# Altium schematic sheet bootloader.SchDoc
size A4
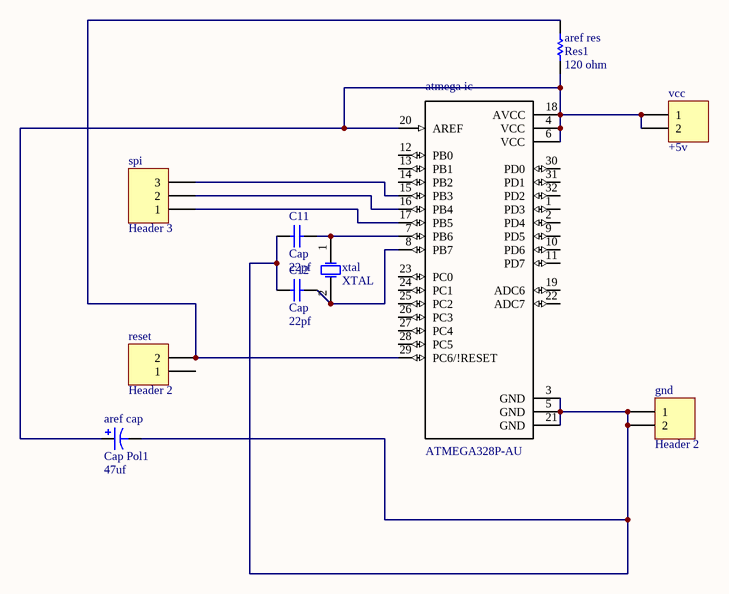
[diagram p0: bootloader.SchDoc]

## Parts
aref_cap  Cap Pol1  value 47uf  [RB7.6-15]
aref_res  Res1  value 120 ohm  [AXIAL-0.3]
atmega_ic  ATMEGA328P-AU  [*QFP80P900X900X120-32N]
C11  Cap  value 22pf  [RAD-0.3]
C12  Cap  value 22pf  [RAD-0.3]
gnd  Header 2  [HDR1X2]
reset  Header 2  [HDR1X2]
spi  Header 3  [HDR1X3]
vcc  +5v  [HDR1X2]
xtal  XTAL  [R38]

## Nets
Netaref_cap_1: aref_cap.1 aref_res.1 atmega_ic.4(VCC) atmega_ic.6(VCC) atmega_ic.18(AVCC) atmega_ic.20(AREF) vcc.1 vcc.2
Netaref_cap_2: aref_cap.2 atmega_ic.3(GND) atmega_ic.5(GND) atmega_ic.21(GND) C11.1 C12.1 gnd.1 gnd.2
Netaref_res_2: aref_res.2 atmega_ic.29(PC6/!RESET) reset.2
Netatmega_ic_7: atmega_ic.7(PB6) C11.2 xtal.1(OSC1)
Netatmega_ic_8: atmega_ic.8(PB7) C12.2 xtal.2(OSC2)
Netatmega_ic_15: atmega_ic.15(PB3) spi.3
Netatmega_ic_16: atmega_ic.16(PB4) spi.2
Netatmega_ic_17: atmega_ic.17(PB5) spi.1

Not connected (* = marked no-connect by the designer): atmega_ic 1(PD3) 2(PD4) 9(PD5) 10(PD6) 11(PD7) 12(PB0) 13(PB1) 14(PB2) 19(ADC6) 22(ADC7) 23(PC0) 24(PC1) 25(PC2) 26(PC3) 27(PC4) 28(PC5) 30(PD0) 31(PD1) 32(PD2); reset 1

## Library data of the parts
aref_cap = Cap Pol1: Polarized Capacitor (Radial); Published: 8-Jun-2000; LatestRevisionDate: 17-Jul-2002; LatestRevisionNote: Re-released for DXP Platform.; PackageReference: RB7.6-15; Publisher: Altium Limited; PackageDescription: Polarized Capacitor (Radial); 2 Leads
aref_res = Res1: Resistor; Published: 8-Jun-2000; LatestRevisionDate: 17-Jul-2002; LatestRevisionNote: Re-released for DXP Platform.; PackageReference: AXIAL-0.3; Publisher: Altium Limited; PackageDescription: Axial Device, Thru-Hole; 2 Leads; 0.3 in Pin Spacing
atmega_ic = ATMEGA328P-AU: Microcontroller Mcu, 8 Bit, Atmega, 20mhz, Tqfp-32; MF: Microchip; SnapEDA_Link: https://www.snapeda.com/parts/ATMEGA328P-AU/Microchip/view-part/?ref=snap; Digi-Key_Purchase_URL: https://www.digikey.com/product-detail/en/microchip-technology/ATMEGA328P-AU/ATMEGA328P-AU-ND/1832260?utm_source=snapeda&utm_medium=aggregator&utm_campaign=symbol; Digi-Key_Part_Number: ATMEGA328P-AU-ND; Package: TQFP-32 Microchip; MP: ATMEGA328P-AU; Value: *
C11 C12 = Cap: Capacitor; Published: 8-Jun-2000; LatestRevisionDate: 17-Jul-2002; LatestRevisionNote: Re-released for DXP Platform.; PackageReference: RAD-0.3; Publisher: Altium Limited; PackageDescription: Radial Cap, Thru-Hole; 2 Leads; 0.3 in Pin Spacing
gnd reset vcc = Header 2: Header, 2-Pin; LatestRevisionDate: 17-Jul-2002; LatestRevisionNote: Re-released for DXP Platform.; Publisher: Altium Limited
spi = Header 3: Header, 3-Pin; LatestRevisionDate: 17-Jul-2002; LatestRevisionNote: Re-released for DXP Platform.; Publisher: Altium Limited
xtal = XTAL: Crystal Oscillator; Published: 8-Jun-2000; LatestRevisionDate: 17-Jul-2002; LatestRevisionNote: Re-released for DXP Platform.; PackageReference: R38; Publisher: Altium Limited; PackageDescription: Crystal, Thru-Hole; 2 Leads; Body 3.1 x 8.2 mm (Dia.xH)